# Altium schematic sheet buck.SchDoc
size A; SheetNumber: 2; SheetTotal: 2
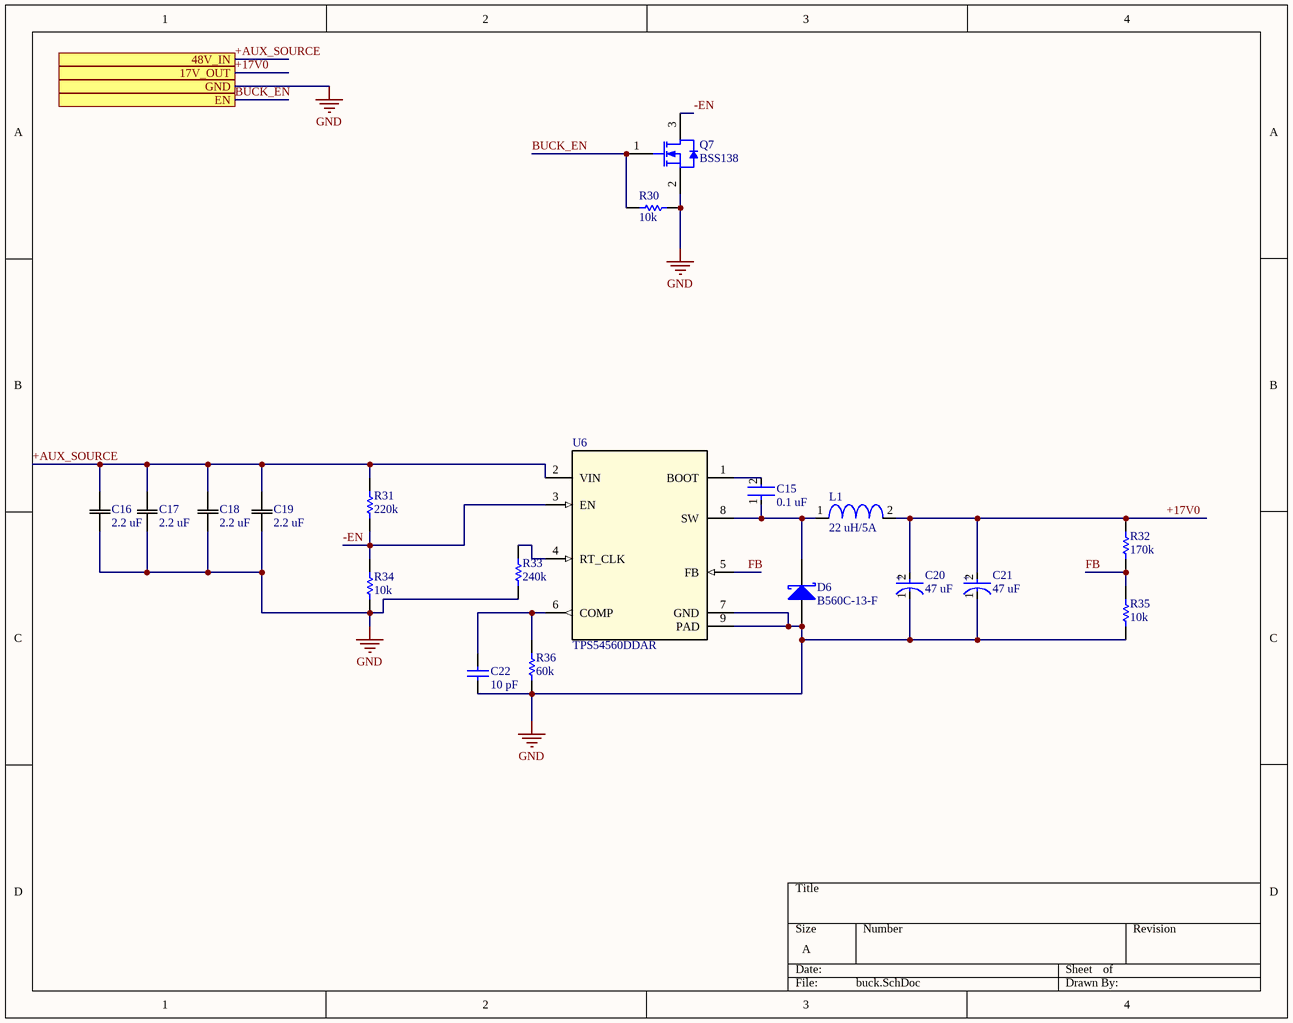
[diagram p0: buck.SchDoc]

## Parts
C15  0.1 uF  [FP-CC0603-DA-MFG]
C16  2.2 uF  [CAP_GMC32_2.8H_CCE]
C17  2.2 uF  [CAP_GMC32_2.8H_CCE]
C18  2.2 uF  [CAP_GMC32_2.8H_CCE]
C19  2.2 uF  [CAP_GMC32_2.8H_CCE]
C20  47 uF  [FP-FPD-MFG]
C21  47 uF  [FP-FPD-MFG]
C22  10 pF  [CAPC1608X90X35LL10T15]
D6  B560C-13-F  [DIOD-B5X0C-2_M]
L1  22 uH/5A  [SMPI06050-220M]
Q7  BSS138  [FAIR-SOT23-3_V]
R30  10k  [RESC1609X50X30NL8T20]
R31  220k  [RESC1609X50X30NL8T20]
R32  170k  [RESC1609X50X30NL8T20]
R33  240k  [RESC1609X50X30NL8T20]
R34  10k  [RESC1609X50X30NL8T20]
R35  10k  [RESC1609X50X30NL8T20]
R36  60k  [RESC1609X50X30NL8T20]
U6  TPS54560DDAR  [DDA0008E_N]

## Ports
17V_OUT (see Ups_Design2[6A]), 48V_IN (see Ups_Design2[5A]), EN (see Ups_Design2[6A]), GND (see Ups_Design2[5A])

## Nets
GND: C16.1 C17.1 C18.1 C19.1 C20.1(C) C21.1(C) C22.1 D6.2(A) Q7.2(S) R30.1 R33.1 R34.1 R35.1 R36.1 U6.7(GND) U6.9(PAD) ; port GND
+17V0: C20.2(A) C21.2(A) L1.2 R32.2 ; port 17V_OUT
+AUX_SOURCE: C16.2 C17.2 C18.2 C19.2 R31.2 U6.2(VIN) ; port 48V_IN
-EN: Q7.3(D) R31.1 R34.2 U6.3(EN)
BUCK_EN: Q7.1(G) R30.2 ; port EN
FB: R32.1 R35.2 U6.5(FB)
NetC15_1: C15.1 D6.1(K) L1.1 U6.8(SW)
NetC15_2: C15.2 U6.1(BOOT)
NetC22_2: C22.2 R36.2 U6.6(COMP)
NetR33_2: R33.2 U6.4(RT_CLK)

## Notes on the sheet
- (in symbol CMP-2000-06216-2) +

## Library data of the parts
C15 = CMP-2000-05002-2: CAP CER 0.1UF 16V X7R 0603; Manufacturer Part Number: CC0603KRX7R7BB104; Manufacturer: YAGEO; Tolerance: 0.1; Value: 100 nF; Temperature Coefficient: 15%; Material: Ceramic; Voltage Rating: 16 V; Package: CC0603-DA; ComponentLink2Description: Datasheet; Octopart: https://octopart.com/cc0603krx7r7bb104-yageo-192941; Temperature Range High: +125°C; Digikey Description: CAP CER 0.1UF 16V X7R 0603; Voltage: 16 V; Device Class L2: Capacitors; Height: 0.9mm; Temperature: -55°C to +125°C; Device Class L1: Passive Components; Device Class L3: Ceramic Capacitors; ComponentLink2URL: http://www.yageo.com/documents/recent/UPY-GPHC_X7R_6.3V-to-50V_18.pdf; Footprint Url: http://www.yageo.com/exep/pages/download/literatures/UPY-C_GEN_24.pdf; RoHS: TRUE; Temperature Range Low: -55°C; Temperature Characteristic: X7R; Lead Free: Yes; Capacitance: 100 nF; Category: Cap; Mouser Description: Multilayer Ceramic Capacitor, CC Series, 0.1 - F, - 10%, X7R, 16 V, 0603 [1608 Metric]; Automotive: No
C16-C19 = GMC32X7R225K100NT: GMC32X7R225K100NT-CAP CER 2.2UF 100V X7R 1210; Mfr_Name: Cal-Chip Electronics; Type: DEV; Copyright: Copyright (C) 2023 Ultra Librarian. All rights reserved.; Manufacturer_Part_Number: GMC32X7R225K100NT; RefDes: RefDes
C20 C21 = CMP-2000-06216-2: CAP ALUM 47UF 20% 35V SMD; Life (Hours): 2000Hour; Leakage Current: 3uA; Dissipation Factor: 0.12%; Material: Aluminium; Ripple Current (AC): 300mA; ESR (Equivalent Series Resistance): 260mR; Construction: Cylindrical; Contact Plating: Tin; Termination: SMD/SMT; RoHS Compliant: Yes; Voltage Rating (DC): 35V; Package Quantity: 1; Tolerance: 20%; Mount: Surface Mount; Diameter: 6.3mm; Lead Free: Lead Free; Number of Pins: 2; Radiation Hardening: No; Series: FP; REACH SVHC: No SVHC; Length: 5.8mm; Height - Seated (Max): 0.228inch; Capacitance: 47uF; Packaging: Tape and Reel; Voltage Rating: 35V; Min Operating Temperature: -55°C; Voltage: 35V; Case/Package: Radial; Max Operating Temperature: 105°C; Ripple Current: 300mA; Height: 5.8mm; Lead Pitch: 1.8mm
C22 = CMP-2006-02592-1: Multilayer Ceramic Capacitor, 10 pF, 50 V, ± 5%, C0G (NP0), 0603 [1608 Metric]; Part Number: GRM1885C1H100JA01D; Manufacturer: Murata
D6 = CMP-2000-05098-2: Schottky Barrier Rectifier, 5 A, 60 V, -55 to 125 degC, 2-Pin SMD, RoHS, Tape and Reel; Ir - Reverse Current: 500uA; Configuration: Single; Ifsm - Forward Surge Current: 100A; Vrrm - Repetitive Reverse Voltage: 60V; Brand: DiodesIncorporated; Vf - Forward Voltage: 0.7V; If - Forward Current: 5A; Unit Weight: 0.007408oz; Type: SchottkyBarrierRectifier; Package / Case: SMC; Manufacturer URL: http://www.diodes.com/; Datasheet URL: https://datasheet.ciiva.com/27052/1538961-27052355.pdf; Factory Pack Quantity: 3000; Height: 2.5mm; Width: 6.22mm; Product Category: SchottkyDiodes&Rectifiers; Minimum Operating Temperature: -55C; Manufacturer: DiodesIncorporated; Datasheet Version: Rev. 7-2, 06/2007; Product: SchottkyDiodes; Maximum Operating Temperature: +125C; Operating Temperature Range: -55Cto+125C; Technology: Si; Length: 7.11mm; RoHS: True; Packaging: Reel; Termination Style: SMD/SMT; Series: B560; Mounting Style: SMD/SMT
L1 = SMPI06050-220M: INDUCTOR POWER 22UH 7.7X6.6MM SMD
Q7 = CMP-013-00021-2: N-Channel Logic Level Enhancement Mode Field Effect Transistor, 220 mA, 50 V, -55 to 150 degC, 3-Pin SOT-23, RoHS, Tape and Reel; Manufacturer: Fairchild; Nominal Vgs: 1.3V; Rds On Max: 3.5Ohm; Nominal Dual Supply Voltage: 50V; Package Version: Rev. 12, 03/2016; Typical Rise Time: 9ns; Elements: 1; Power: 360mW; Input Capacitance: 27pF; Resistance: 0.7Ohm; Package Reference: SOT23-3; Package Quantity: 1; Pins: 3; Mounting Technology: SM; Datasheet URL: https://www.fairchildsemi.com/datasheets/BS/BSS138.pdf; Max Operating Temperature: 150°C; Min Operating Temperature: -55°C; Datasheet Version: Rev. C, 10/2005; Package Description: 3-Pin Small Outline Transistor, Body 2.92 x 1.325 mm, Pitch 0.95 mm; Case/Package: TO-236-3; Packaging: TapeandReel; RoHS Compliant: True
R30-R36 = CMP-1666-00005-4: Chip Resistor, 10 KOhm, +/- 1%, 100 mW, -55 to 155 degC, 0603 (1608 Metric), RoHS, Tape and Reel; Manufacturer: Vishay Semiconductor; Voltage Rating: 75 V; Max Operating Temperature: 155 degC; PackageDescription: 2-Pin Surface Mount Device, Body 1.575 x 0.85 mm; ComponentLink1Description: Manufacturer URL; RoHSCompliant: true; PackageReference: 0603; REACH SVHC: Unknown; Length: 1.55 mm; DatasheetVersion: 06/2012; Packaging: Tape and Reel; Min Operating Temperature: -55 degC; Mounting Technology: Surface Mount; ComponentLink2URL: https://datasheet.ciiva.com/11809/0900766b80d98afc-11809037.pdf; Height: 0.45 mm; ComponentLink2Description: Datasheet; Package Quantity: 5000; ComponentLink1URL: http://www.vishay.com/
U6 = TPS54560DDAR: No Description Available; Mfr_Name: Texas Instruments; Type: DEV; RefDes: RefDes; Copyright: Copyright (C) 2023 Ultra Librarian. All rights reserved.; Manufacturer_Part_Number: TPS54560DDAR